# EAGLE design cellSwitcher_ni_mh_V6 (EAGLE 9.4.2)
DESIGNER: Juan J. Rojas; INSTITUTION: Kyushu Institute of Technology; PROJECT_NAME: Cell Switcher; VERSION: 5
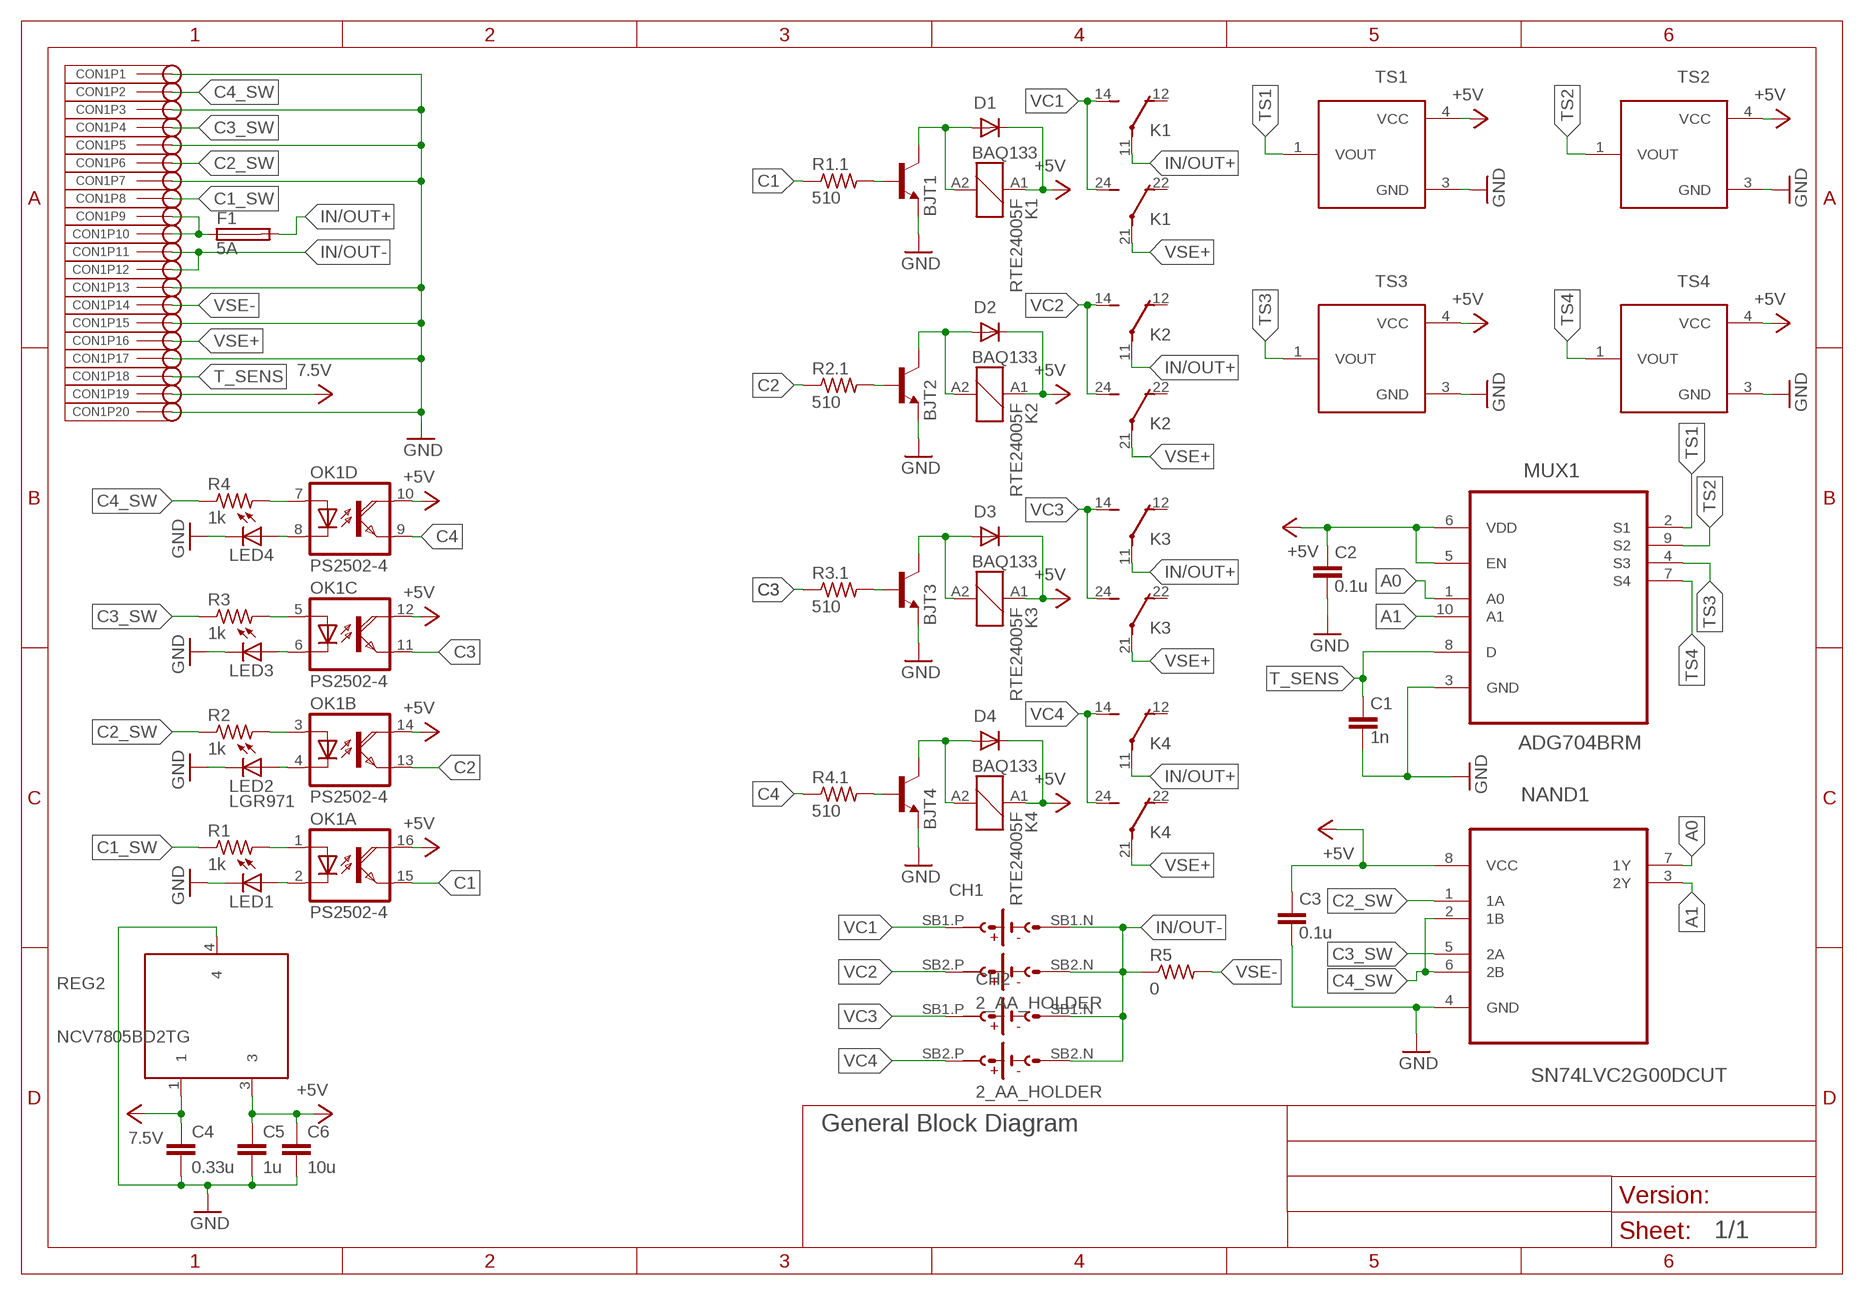
[diagram p0: schematic, sheet 1]
FRAME2 (A4L-JUANJO): TITLE: General Block Diagram

## Parts
BJT1  BC818K-40  [SOT-23]
BJT2  BC818K-40  [SOT-23]
BJT3  BC818K-40  [SOT-23]
BJT4  BC818K-40  [SOT-23]
C1  1n  NONPOL_CAP-0603  [C0603]
C2  0.1u  NONPOL_CAP-0603  [C0603]
C3  0.1u  NONPOL_CAP-0603  [C0603]
C4  0.33u  NONPOL_CAP-0603  [C0603]
C5  1u  NONPOL_CAP-0603  [C0603]
C6  10u  NONPOL_CAP-0603  [C0603]
CH1  2_AA_HOLDER  [2_AA_HOLDER]
CH2  2_AA_HOLDER  [2_AA_HOLDER]
CON1  TMM-110-01-F-D-RA  [TMM-110-01-F-D-RA]
D1  BAQ133  DIODE-BAQ133-GS08  [SOD08]
D2  BAQ133  DIODE-BAQ133-GS08  [SOD08]
D3  BAQ133  DIODE-BAQ133-GS08  [SOD08]
D4  BAQ133  DIODE-BAQ133-GS08  [SOD08]
F1  5A  FUSEHOLDER  [SH22,5]
K1  RTE24005F  [RTE24005F]
K2  RTE24005F  [RTE24005F]
K3  RTE24005F  [RTE24005F]
K4  RTE24005F  [RTE24005F]
LED1  LGR971  [SML0805]
LED2  LGR971  [SML0805]
LED3  LGR971  [SML0805]
LED4  LGR971  [SML0805]
MUX1  ADG704BRM  [MSOP10]
NAND1  SN74LVC2G00DCUT  [VSSOP-8]
OK1  PS2502-4  [DIL16]
R1  1k  RESISTOR-0603  [R0603]
R1.1  510  RESISTOR-0603  [R0603]
R2  1k  RESISTOR-0603  [R0603]
R2.1  510  RESISTOR-0603  [R0603]
R3  1k  RESISTOR-0603  [R0603]
R3.1  510  RESISTOR-0603  [R0603]
R4  1k  RESISTOR-0603  [R0603]
R4.1  510  RESISTOR-0603  [R0603]
R5  0  RESISTOR-0603  [R0603]
REG2  NCV7805BD2TG  [D2PAK-3]
TS1  STLM20DD9F  [UDFN-4L]
TS2  STLM20DD9F  [UDFN-4L]
TS3  STLM20DD9F  [UDFN-4L]
TS4  STLM20DD9F  [UDFN-4L]

## Nets
7.5V: C4.1 CON1.19 REG2.1
+5V: C2.1 C3.1 C5.1 C6.1 D1.C D2.C D3.C D4.C K1.A1 K2.A1 K3.A1 K4.A1 MUX1.5(EN) MUX1.6(VDD) NAND1.8(VCC) OK1.10(D:COL) OK1.12(C:COL) OK1.14(B:COL) OK1.16(A:COL) REG2.3 TS1.4(VCC) TS2.4(VCC) TS3.4(VCC) TS4.4(VCC)
A0: MUX1.1(A0) NAND1.7(1Y)
A1: MUX1.10(A1) NAND1.3(2Y)
C1: OK1.15(A:EMI) R1.1.1
C1_SW: CON1.8 R1.1
C2: OK1.13(B:EMI) R2.1.1
C2_SW: CON1.6 NAND1.1(1A) R2.1
C3: OK1.11(C:EMI) R3.1.1
C3_SW: CON1.4 NAND1.5(2A) R3.1
C4: OK1.9(D:EMI) R4.1.1
C4_SW: CON1.2 NAND1.2(1B) NAND1.6(2B) R4.1
GND: BJT1.2(E) BJT2.2(E) BJT3.2(E) BJT4.2(E) C1.2 C2.2 C3.2 C4.2 C5.2 C6.2 CON1.1 CON1.3 CON1.5 CON1.7 CON1.13 CON1.15 CON1.17 CON1.20 LED1.C LED2.C LED3.C LED4.C MUX1.3(GND) NAND1.4(GND) REG2.4 TS1.3(GND) TS2.3(GND) TS3.3(GND) TS4.3(GND)
IN/OUT+: F1.2 K1.11(2:COM) K2.11(2:COM) K3.11(2:COM) K4.11(2:COM)
IN/OUT+1: CON1.9 CON1.10 F1.1
IN/OUT-: CH1.SB1.N(B1.N) CH1.SB2.N(B2.N) CH2.SB1.N(B1.N) CH2.SB2.N(B2.N) CON1.11 CON1.12 R5.1
N$1: BJT1.1(B) R1.1.2
N$2: BJT2.1(B) R2.1.2
N$3: BJT3.1(B) R3.1.2
N$4: BJT3.3(C) D3.A K3.A2
N$5: LED1.A OK1.2(A:C)
N$6: LED2.A OK1.4(B:C)
N$7: LED3.A OK1.6(C:C)
N$8: LED4.A OK1.8(D:C)
N$9: OK1.7(D:A) R4.2
N$10: OK1.5(C:A) R3.2
N$11: OK1.3(B:A) R2.2
N$12: OK1.1(A:A) R1.2
N$13: BJT1.3(C) D1.A K1.A2
N$14: BJT2.3(C) D2.A K2.A2
N$15: BJT4.1(B) R4.1.2
N$16: BJT4.3(C) D4.A K4.A2
T_SENS: C1.1 CON1.18 MUX1.8(D)
TS1: MUX1.2(S1) TS1.1(VOUT)
TS2: MUX1.9(S2) TS2.1(VOUT)
TS3: MUX1.4(S3) TS3.1(VOUT)
TS4: MUX1.7(S4) TS4.1(VOUT)
VC1: CH1.SB1.P(B1.P) K1.14(2:NO) K1.24(3:NO)
VC2: CH1.SB2.P(B2.P) K2.14(2:NO) K2.24(3:NO)
VC3: CH2.SB1.P(B1.P) K3.14(2:NO) K3.24(3:NO)
VC4: CH2.SB2.P(B2.P) K4.14(2:NO) K4.24(3:NO)
VSE+: CON1.16 K1.21(3:COM) K2.21(3:COM) K3.21(3:COM) K4.21(3:COM)
VSE-: CON1.14 R5.2
Unconnected: K1.12(2:NC) K1.22(3:NC) K2.12(2:NC) K2.22(3:NC) K3.12(2:NC) K3.22(3:NC) K4.12(2:NC) K4.22(3:NC)

## Library data of the parts
BJT1-BJT4 = ICs:BC818K-40
C1-C6 = Pasives:NONPOL_CAP
CH1 CH2 = Sources:2_AA_HOLDER
CON1 = Interfaces:TMM-110-01-F-D-RA
D1-D4 = Pasives:DIODE
F1 = Pasives:FUSEHOLDER: FUSE HOLDER grid 22,5 mm, OGN0031 8201, Schurter (Buerklin); MF: SCHURTER; MPN: 0031.8201
K1-K4 = Electromechanical:RTE24005F: Power PCB Relay polarized bistable version SCHRACK 2 pole 8 A Source: http://www.schrack.com/.. 5843.pdf
LED1-LED4 = Pasives:LGR971
MUX1 = ICs:ADG704BRM: MSOP-10,4-Channel Multiplexer; MPN: ADG704BRM-REEL; OC_FARNELL: unknown; OC_NEWARK: 09B7139; PACKAGE: MSOP-10; SUPPLIER: Analog Devices
NAND1 = ICs:SN74LVC2G00DCUT: DUAL 2-INPUT POSITIVE-NAND GATE; MPN: SN74LVC2G00DCUT; PACKAGE: VSSOP-8; SUPPLIER: Texas Instruments
OK1 = ICs:PS2502-4: PS2502-4
R1 R1.1 R2 R2.1 R3 R3.1 R4 R4.1 R5 = Pasives:RESISTOR: RESISTOR
REG2 = ICs:NCV7805BD2TG
TS1-TS4 = ICs:STLM20

## Board
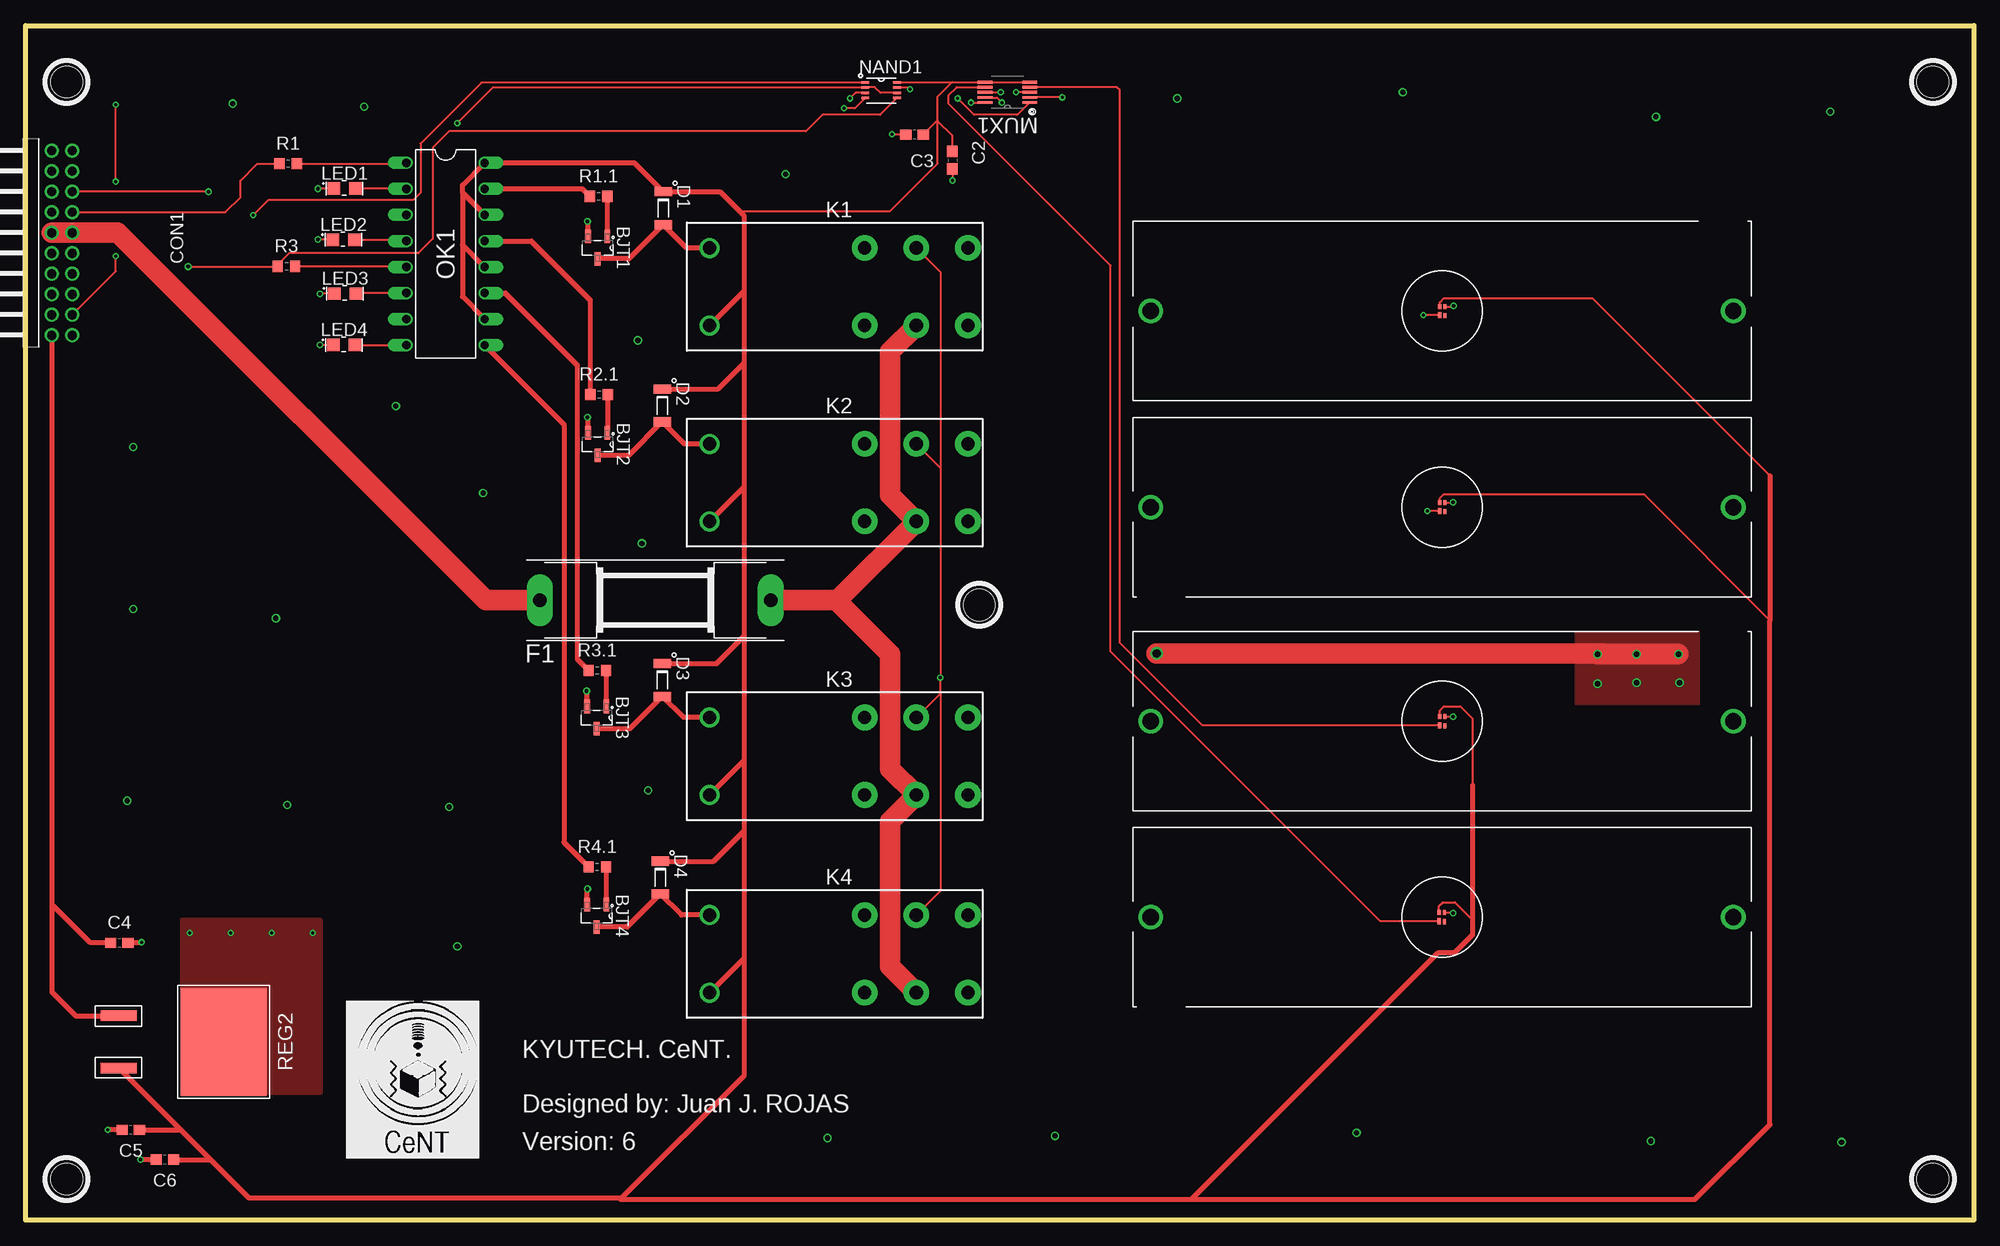
[diagram p1: board, top side]
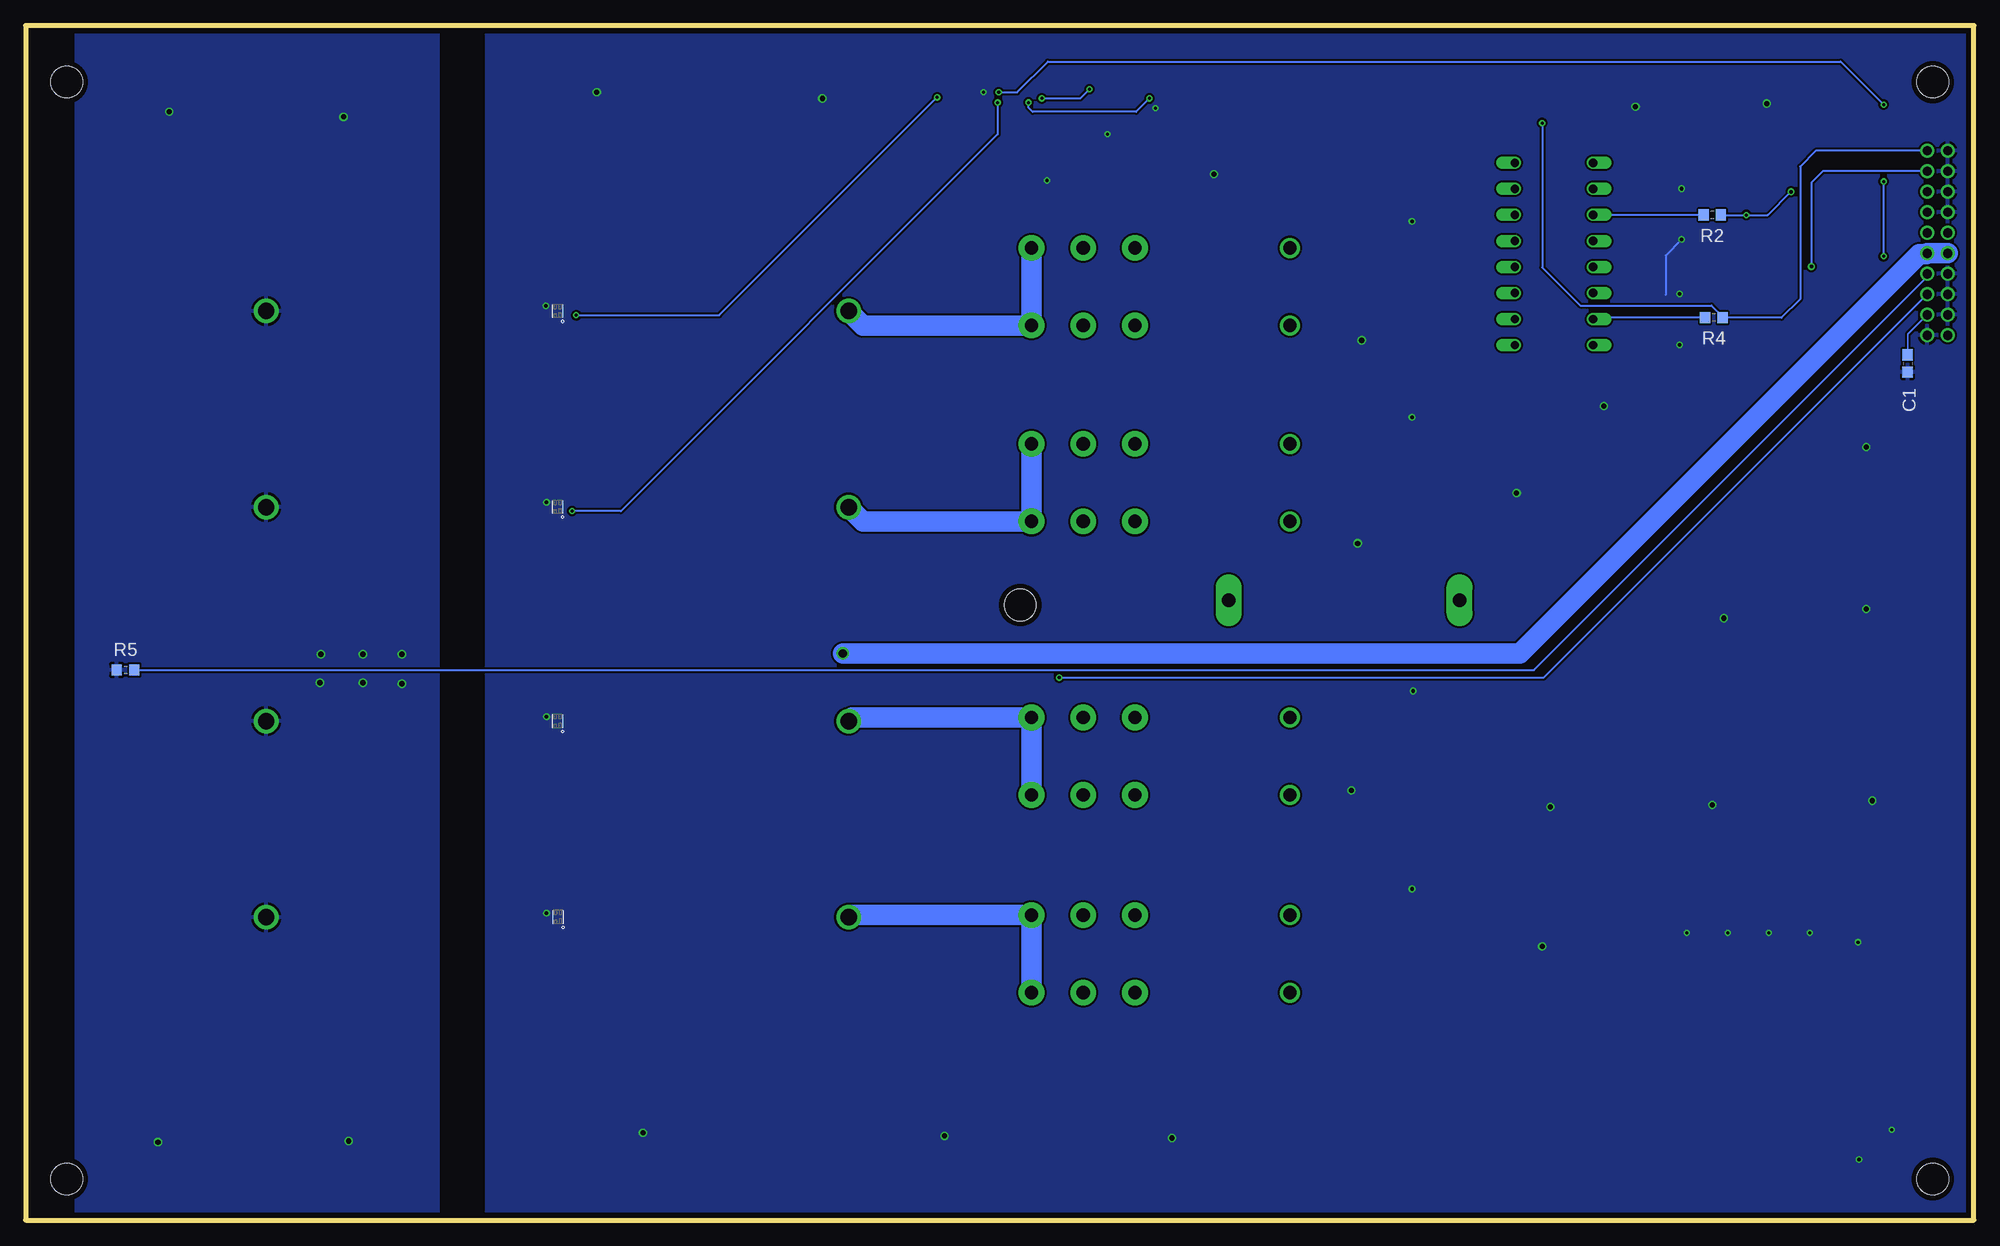
[diagram p2: board, bottom side, seen from below]

Size 190 x 116.5 mm. Coordinates in mm from the lower left corner, seen from the top.
Outline: 0,116.5 190,116.5 190,0 0,0 0,116.5
Copper layers (1*16): Top 0.035mm / dielectric 1.53mm / Bottom 0.035mm
Design rules "pban_5mil-l2": minimum track width 5mil, minimum drill 0.3mm, track to track 5mil, track to pad 0.229mm, pad to pad 5mil, via to via 5mil, smd to smd 5mil, copper to edge 0.5mm, drill to drill 0.5mm, minimum pad ring 0.15mm, minimum via ring 0.15mm, stop-mask expansion 4mil, vias tented up to drill 0.35mm, thermal gap 10mil
Holes 3.1 mm at 4,111 4,4 186,4 186,111 93,60

### Footprints (pad centres in the part's own frame; a part is rotated, then mirrored left to right if it is on the bottom)
SOT-23 = smd 1.321 x 0.559: 1 -1.092,0.94; 2 -1.092,-0.94; 3 1.092,0
C0603 = smd 1.1 x 1: 1 -0.85,0; 2 0.85,0
2_AA_HOLDER = drill 1.6: SB1.N 28.4,9.565; SB1.P -28.4,9.565; SB2.N 28.4,-9.565; SB2.P -28.4,-9.565
TMM-110-01-F-D-RA = drill 0.914 pad 1.372: 1 -9,-1; 2 -9,1; 3 -7,-1; 4 -7,1; 5 -5,-1; 6 -5,1; 7 -3,-1; 8 -3,1; 9 -1,-1; 10 -1,1; 11 1,-1; 12 1,1; 13 3,-1; 14 3,1; 15 5,-1; 16 5,1; 17 7,-1; 18 7,1; 19 9,-1; 20 9,1
SOD08 = smd 0.9 x 1.7: A 1.6,0; C -1.6,0
SH22,5 = drill 1.321 pad 2.54 long: 1 -11.252,0; 2 11.252,0
RTE24005F = drill 1.3 pad 2.5: 11 7.56,-3.68; 12 2.52,-3.68; 14 12.6,-3.68; 21 7.56,3.88; 22 2.52,3.88; 24 12.6,3.88 | drill 1.3: A1 -12.6,-3.68; A2 -12.6,3.88
SML0805 = smd 1.2 x 1.2: A 1.05,0; C -1.05,0
MSOP10 = smd 1.422 x 0.279: 1 -2.184,0.991; 2 -2.184,0.508; 3 -2.184,0; 4 -2.184,-0.508; 5 -2.184,-0.991; 6 2.184,-0.991; 7 2.184,-0.508; 8 2.184,0; 9 2.184,0.508; 10 2.184,0.991
VSSOP-8 = smd 0.75 x 0.25: 1 -1.55,0.75; 2 -1.55,0.25; 3 -1.55,-0.25; 4 -1.55,-0.75; 5 1.55,-0.75; 6 1.55,-0.25; 7 1.55,0.25; 8 1.55,0.75
DIL16 = drill 0.813 offset: 1 -8.89,-3.81; 2 -6.35,-3.81; 3 -3.81,-3.81; 4 -1.27,-3.81; 5 1.27,-3.81; 6 3.81,-3.81; 7 6.35,-3.81; 8 8.89,-3.81; 9 8.89,3.81; 10 6.35,3.81; 11 3.81,3.81; 12 1.27,3.81; 13 -1.27,3.81; 14 -3.81,3.81; 15 -6.35,3.81; 16 -8.89,3.81
R0603 = smd 1 x 1.1: 1 -0.85,0; 2 0.85,0
D2PAK-3 = smd 1.016 x 3.504: 1 -2.54,-10.213; 3 2.54,-10.213 | smd 10.49 x 8.38: 4 0,0
UDFN-4L = smd 0.6 x 0.3: 1 -0.4,0.25 | smd 0.5 x 0.3: 2 -0.45,-0.25; 3 0.45,-0.25; 4 0.45,0.25

### Placement (x,y rotation side)
BJT1  55.79,94.84 270 top
BJT2  55.79,75.67 270 top
BJT3  55.69,49 270 top
BJT4  55.69,29.68 270 top
C1  6.46,83.55 270 bottom
C2  90.38,103.38 270 top
C3  86.69,105.86 180 top
C4  9.14,27.04 0 top
C5  10.26,8.79 180 top
C6  13.58,5.89 180 top
CH1  138.14,79.1 0 top
CH2  138.14,39.1 0 top
CON1  3.55,95.3 270 top
D1  62.18,98.7 270 top
D2  62.09,79.46 270 top
D3  62.09,52.68 270 top
D4  61.89,33.4 270 top
F1  61.41,60.46 0 top
K1  79.3,90.94 0 top
K2  79.3,71.82 0 top
K3  79.3,45.14 0 top
K4  79.3,25.86 0 top
LED1  31.11,100.61 0 top
LED2  31.01,95.61 0 top
LED3  31.16,90.36 0 top
LED4  31.06,85.36 0 top
MUX1  95.75,110 180 top
NAND1  83.44,110.2 0 top
OK1  40.96,94.23 270 top
R1  25.6,103.03 0 top
R1.1  55.87,99.85 0 top
R2  25.52,98.03 180 bottom
R2.1  55.92,80.52 0 top
R3  25.44,93.03 0 top
R3.1  55.75,53.6 0 top
R4  25.36,88.03 180 bottom
R4.1  55.75,34.44 0 top
R5  180.26,53.65 0 bottom
REG2  19.31,17.38 270 top
TS1  138.15,88.65 90 top
TS2  138.15,69.55 90 top
TS3  138.15,48.65 90 top
TS4  138.1,29.55 90 top

### Tracks (layer width: path | path; a pad name or v marks a point on that pad's centre or on a via)
7.5V
  Top 0.5: CON1.19 2.55,30.8 | 2.55,30.8 2.55,22.25 4.9,19.9 9.08,19.9 REG2.1 | C4.1 6.31,27.04 2.55,30.8
+5V
  Top 0.2: MUX1.5 MUX1.6 90.35,110.99 | NAND1.8 84.96,110.95 85,110.99 90.35,110.99 | 69.64,98.39 84.28,98.39 88.95,103.05 88.95,107.2 | 88.95,107.2 88.95,107.27 | 88.95,107.27 88.95,109.59 90.35,110.99 | C3.1 88.95,107.27 | C2.1 90.38,105.77 88.95,107.2 | TS2.4 137.9,70.4 138.3,70.8 157.8,70.8 170.1,58.5 | TS1.4 137.92,89.12 137.92,89.49 138.34,89.9 152.8,89.9 170.1,72.6 | TS3.4 137.9,49.7 138.3,50.1 139.9,50.1 141.1,48.9 141.1,42.4 | TS4.4 137.85,30.65 138.2,31 139.4,31 141.1,29.3
  Top 0.5: 70.05,90.61 70.05,97.97 69.64,98.39 67.72,100.3 D1.C 59.36,103.12 OK1.16 42.6,100.95 42.6,100.21 | 70.05,90.61 70.05,83.6 | 70.05,83.6 70.05,71.49 | 70.05,71.49 70.05,56.96 | 70.05,56.96 70.05,44.81 | 70.05,44.81 70.05,37.96 | 70.05,37.96 70.05,25.53 | 70.05,25.53 70.05,14.07 58.14,2.16 | 58.14,2.16 57.99,2.01 113.71,2.01 | D2.C 67.51,81.06 70.05,83.6 | K1.A1 70.05,90.61 | D3.C 67.37,54.28 70.05,56.96 | K2.A1 70.05,71.49 | K3.A1 70.05,44.81 | K4.A1 70.05,25.53 | D4.C 67.09,35 70.05,37.96 | REG2.3 15.15,8.79 | 15.15,8.79 18.05,5.89 | 58.14,2.16 21.78,2.16 18.05,5.89 | OK1.10 42.6,90.05 42.6,95.13 | 42.6,100.21 42.6,95.13 | OK1.12 42.6,95.13 | OK1.14 42.6,100.21 | 113.71,2.01 137.8,26.1 139.4,26.1 141.1,27.8 141.1,29.3 141.1,42.4 | C5.1 15.15,8.79 | C6.1 18.05,5.89 | 113.71,2.01 162.81,2.01 170.1,9.3 170.1,58.5 170.1,72.6
A0  (via drill 0.3)
  Top 0.2: MUX1.1 96.72,107.8 92.5,107.8 v90.9,109.4 | v86.25,110.3 86.1,110.45 NAND1.7
  Bottom 0.2: v90.9,109.4 87.15,109.4 v86.25,110.3
A1  (via drill 0.3)
  Top 0.2: NAND1.3 80.95,109.95 v80.4,109.4 | v92.2,109 93.56,109 MUX1.10
  Bottom 0.2: v80.4,109.4 81.7,108.1 91.8,108.1 92.2,108.5 v92.2,109
C1
  Top 0.5: OK1.15 54.29,100.58 R1.1.1
C1_SW
  Top 0.2: CON1.8 19.47,98.29 20.97,99.79 20.97,101.4 22.6,103.03 R1.1
C2
  Top 0.5: OK1.13 49.3,95.5 55.07,89.73 R2.1.1
C2_SW  (via drill 0.3, 0.35)
  Top 0.2: v17.83,100.3 CON1.6 | NAND1.1 44.45,110.95 38.5,105 38.5,100.2 37.8,99.5 23.67,99.5 v22.2,98.03
  Bottom 0.2: R2.1 v22.2,98.03 20.1,98.03 v17.83,100.3
C3
  Top 0.5: OK1.11 46.78,90.42 53.8,83.4 53.8,54.7 R3.1.1
C3_SW  (via drill 0.35)
  Top 0.2: v15.85,93 24.4,93 | 24.4,93 24.56,93 R3.1 | 24.4,93 25.7,94.3 38.3,94.3 39.7,95.7 39.7,104.6 41.3,106.2 76.1,106.2 77.7,107.8 83.34,107.8 NAND1.5
  Bottom 0.2: CON1.4 14.75,102.29 15.85,101.19 v15.85,93
C4
  Top 0.5: OK1.9 52.5,77.61 52.5,36.84 R4.1.1
C4_SW  (via drill 0.3)
  Top 0.2: NAND1.6 83.35,109.95 82.8,110.5 82.41,110.5 82.4,110.5 81.94,110.5 NAND1.2 45.55,110.45 v42.1,107
  Bottom 0.152: 24.49,88.01 R4.1
  Bottom 0.2: CON1.2 15.42,104.29 16.95,102.76 16.95,89.82 18.76,88.01 24.4,88.01 | 24.4,88.01 24.49,88.01 | v42.1,107 42.1,92.9 38.4,89.2 25.59,89.2 24.4,88.01
GND  (via drill 0.3, 0.35, 0.5)
  Top 0.2: LED1.C v28.5,100.61 v28.49,100.6 | LED2.C 28.53,95.61 v28.49,95.65 | LED3.C v28.71,90.36 v28.7,90.35 | LED4.C v28.72,85.36 v28.71,85.37 | MUX1.3 v96.6,110 | NAND1.4 80.87,108.43 v79.8,108.43 | C3.2 84.54,105.86 v84.5,105.9 | C2.2 90.38,101.42 v90.4,101.4 | v139.2,29.95 139.09,30 TS4.3 | TS3.3 v139.2,49.1 | TS2.3 v139.2,70 | TS1.3 139.14,89.1 v139.25,89.15
  Top 0.5: BJT2.2 54.85,78.25 v54.8,78.3 | BJT1.2 54.85,97.35 v54.8,97.4 | BJT3.2 54.75,51.55 v54.7,51.6 | BJT4.2 54.75,32.25 v54.8,32.3 | C4.2 10.05,27.1 v11.3,27.1 | C5.2 v8.01,8.79 v8,8.8 | C6.2 v11.21,5.89 v11.2,5.9
  Bottom 0.2: v28.49,95.65 30.06,94.08 30.06,90.25
  other vias: 16,28 20,28 24,28 28,28 129.8,8.5 100.4,8.2 78.2,8 42.1,26.7 41.3,40.3 25.5,40.5 9.9,40.9 10.5,59.6 24.4,58.7 10.5,75.4 112.3,109.4 134.3,110 74.1,102 33,108.6 20.2,108.9 36.1,79.4 44.6,70.9 59.7,85.8 60.7,41.9 60.1,66
  pour Bottom (isolate 0.2): 0,0 145,0 145,116.5 0,116.5
  pour Top (no thermals): 15.3,29.3 28.7,29.3 28.7,12.4 15.3,12.4 15.3,22.4
IN/OUT+
  Top 2: K1.11 84.3,84.7 84.3,70.7 K2.11 79.18,60.46 | K4.11 84.3,24.74 84.3,38.9 K3.11 84.3,44.02 84.3,55.2 79.18,60.32 79.18,60.46 | F1.2 79.18,60.46
IN/OUT+1
  Top 2: F1.1 44.84,60.46 9,96.3 CON1.10 CON1.9
IN/OUT-  (via drill 0.5, 0.55, 0.8)
  Top 2: v110.3,55.27 153.83,55.27 | v153.3,55.2 v157.1,55.2 v161.2,55.2
  Bottom 2: CON1.11 CON1.12 4.63,94.22 5.34,94.22 44.29,55.27 v110.3,55.27
  other vias: 153.3,52.3 157.1,52.4 161.3,52.4 158.5,7.7 177.1,7.6 159,107.6 176,108.1
  pour Bottom (isolate 0.2): 149.84,0 185,0 185,116.5 149.84,116.5
  pour Top: 151.2,57.4 163.2,57.4 163.2,50.3 151.2,50.3
N$1
  Top 0.5: R1.1.2 56.72,95.94 BJT1.1
N$2
  Top 0.5: R2.1.2 56.77,76.8 BJT2.1
N$3
  Top 0.5: R3.1.2 56.63,53.57 BJT3.1
N$4
  Top 0.5: K3.A2 64.15,49.02 D3.A 58.92,47.91 BJT3.3
N$5
  Top 0.2: OK1.2 32.19,100.58 LED1.A
N$6
  Top 0.2: LED2.A 37.04,95.61 OK1.4
N$7
  Top 0.2: OK1.6 32.27,90.42 LED3.A
N$8
  Top 0.2: LED4.A 37.13,85.36 OK1.8
N$9
  Bottom 0.152: 37,88.03 OK1.7
  Bottom 0.2: R4.2 37,88.03
N$10
  Top 0.2: R3.2 37.08,93.03 OK1.5
N$11
  Bottom 0.2: R2.2 OK1.3
N$12
  Top 0.2: R1.2 37.06,103.03 OK1.1
N$13
  Top 0.5: K1.A2 64.46,94.82 D1.A 58.83,93.75 BJT1.3
N$14
  Top 0.5: K2.A2 64.25,75.7 D2.A 58.81,74.58 BJT2.3
N$15
  Top 0.5: R4.1.2 56.6,30.8 BJT4.1
N$16
  Top 0.5: K4.A2 63.95,29.74 D4.A 58.68,28.59 BJT4.3
T_SENS  (via drill 0.3)
  Top 0.2: MUX1.8 v95.1,110 | CON1.18 8.8,92.55 v8.8,94 | v8.8,101.3 v8.8,108.8
  Bottom 0.152: CON1.18 6.46,86.39 C1.1
  Bottom 0.2: v95.1,110 93.3,110 90.3,113 13,113 v8.8,108.8 | v8.8,94 v8.8,101.3
TS1  (via drill 0.3)
  Top 0.2: v101.1,109.5 97.94,109.5 MUX1.2 | TS1.1 v136.3,88.25
  Bottom 0.2: v136.3,88.25 122.35,88.25 v101.1,109.5
TS2  (via drill 0.3)
  Top 0.2: MUX1.9 94.71,109.49 v95.2,109 | TS2.1 v136.7,69.15
  Bottom 0.2: v136.7,69.15 131.95,69.15 95.2,105.9 v95.2,109
TS3
  Top 0.2: MUX1.4 106.39,110.51 106.7,110.2 106.7,56.3 114.75,48.25 TS3.1
TS4
  Top 0.2: MUX1.7 90.81,110.51 90,109.7 90,108.9 105.8,93.1 105.8,55.45 132.1,29.15 TS4.1
VC1
  Bottom 2: K1.24 K1.14 108.33,87.26 CH1.SB1.P
VC2
  Bottom 2: K2.24 K2.14 108.34,68.14 CH1.SB2.P
VC3
  Bottom 2: K3.14 K3.24 109.39,49.02 CH2.SB1.P
VC4
  Bottom 2: K4.14 K4.24 109.53,29.74 CH2.SB2.P
VSE+  (via drill 0.3)
  Top 0.2: K1.21 89.2,92.48 89.2,73.36 | K4.21 89.2,32.08 89.2,51.36 | 89.2,51.36 v89.2,52.9 89.2,73.36 | K3.21 89.2,51.36 | K2.21 89.2,73.36
  Bottom 0.2: CON1.16 41.95,52.9 v89.2,52.9
VSE-
  Bottom 0.2: R5.2 155.43,53.65 155.42,53.64 42.91,53.64 4.55,92 CON1.14

### Text on the board
tPlace: KYUTECH. CeNT. / / Designed by: Juan J. ROJAS | Version: 6